# Altium schematic sheet chronos-tubes.SchDoc
size A; SheetNumber: 1; SheetTotal: 9
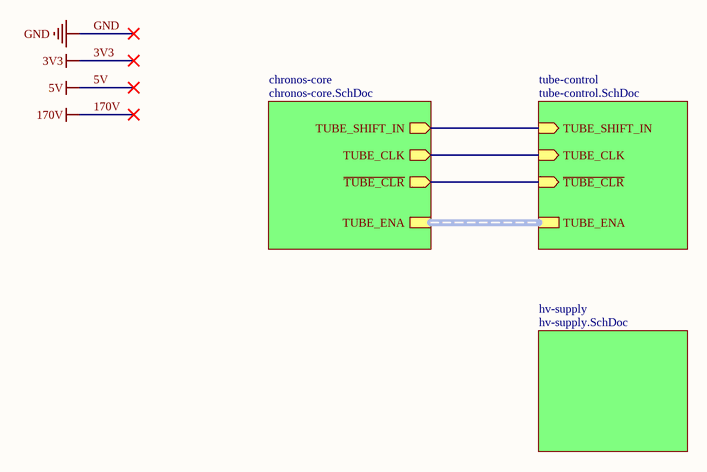
[diagram p0: chronos-tubes.SchDoc]

## Sub-sheets
chronos-core = chronos-core.SchDoc: TUBE_SHIFT_IN (out), TUBE_CLK (out), ~{TUBE_CLR} (out), TUBE_ENA (harness TUBE_ENA)
hv-supply = hv-supply.SchDoc: no entries
tube-control = tube-control.SchDoc: TUBE_SHIFT_IN (in), TUBE_CLK (in), ~{TUBE_CLR} (in), TUBE_ENA (harness TUBE_ENA)

## Nets
(unnamed): sheet chronos-core/TUBE_SHIFT_IN, sheet tube-control/TUBE_SHIFT_IN
(unnamed): sheet chronos-core/TUBE_CLK, sheet tube-control/TUBE_CLK
(unnamed): sheet chronos-core/~{TUBE_CLR}, sheet tube-control/~{TUBE_CLR}

## Buses and harness runs
harness sheet chronos-core/TUBE_ENA = sheet tube-control/TUBE_ENA